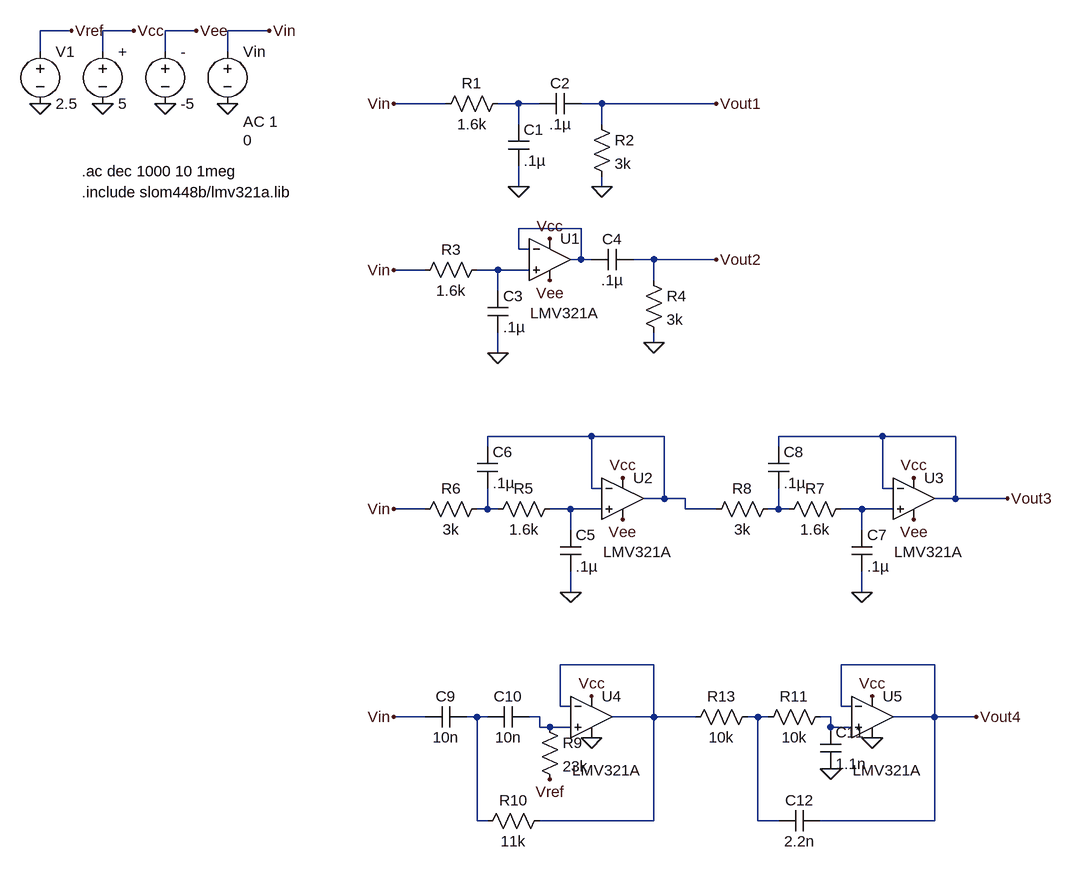
[diagram p0: schematic Draft5.asc]
Draft5.asc, the LTspice schematic file:
Version 4
SHEET 1 1956 1492
WIRE -416 0 -464 0
WIRE -320 0 -368 0
WIRE -224 0 -272 0
WIRE -112 0 -176 0
WIRE -464 32 -464 0
WIRE -368 32 -368 0
WIRE -272 32 -272 0
WIRE -176 32 -176 0
WIRE 160 112 80 112
WIRE 272 112 240 112
WIRE 304 112 272 112
WIRE 400 112 368 112
WIRE 576 112 400 112
WIRE 272 144 272 112
WIRE 400 144 400 112
WIRE 272 240 272 208
WIRE 400 240 400 224
WIRE 368 304 272 304
WIRE 272 336 272 304
WIRE 288 336 272 336
WIRE 368 352 368 304
WIRE 368 352 352 352
WIRE 384 352 368 352
WIRE 480 352 448 352
WIRE 576 352 480 352
WIRE 128 368 80 368
WIRE 240 368 208 368
WIRE 288 368 240 368
WIRE 480 384 480 352
WIRE 240 400 240 368
WIRE 480 480 480 464
WIRE 240 496 240 464
WIRE 384 624 224 624
WIRE 496 624 384 624
WIRE 832 624 672 624
WIRE 944 624 832 624
WIRE 224 640 224 624
WIRE 672 640 672 624
WIRE 384 704 384 624
WIRE 400 704 384 704
WIRE 832 704 832 624
WIRE 848 704 832 704
WIRE 496 720 496 624
WIRE 496 720 464 720
WIRE 528 720 496 720
WIRE 944 720 944 624
WIRE 944 720 912 720
WIRE 1024 720 944 720
WIRE 128 736 80 736
WIRE 224 736 224 704
WIRE 224 736 208 736
WIRE 240 736 224 736
WIRE 352 736 320 736
WIRE 400 736 352 736
WIRE 528 736 528 720
WIRE 576 736 528 736
WIRE 672 736 672 704
WIRE 672 736 656 736
WIRE 688 736 672 736
WIRE 800 736 768 736
WIRE 848 736 800 736
WIRE 352 768 352 736
WIRE 800 768 800 736
WIRE 352 864 352 832
WIRE 800 864 800 832
WIRE 480 976 336 976
WIRE 912 976 768 976
WIRE 336 1040 336 976
WIRE 352 1040 336 1040
WIRE 768 1040 768 976
WIRE 784 1040 768 1040
WIRE 128 1056 80 1056
WIRE 208 1056 192 1056
WIRE 224 1056 208 1056
WIRE 304 1056 288 1056
WIRE 480 1056 480 976
WIRE 480 1056 416 1056
WIRE 544 1056 480 1056
WIRE 640 1056 624 1056
WIRE 656 1056 640 1056
WIRE 752 1056 736 1056
WIRE 912 1056 912 976
WIRE 912 1056 848 1056
WIRE 976 1056 912 1056
WIRE 304 1072 304 1056
WIRE 320 1072 304 1072
WIRE 352 1072 320 1072
WIRE 752 1072 752 1056
WIRE 784 1072 752 1072
WIRE 208 1216 208 1056
WIRE 224 1216 208 1216
WIRE 480 1216 480 1056
WIRE 480 1216 304 1216
WIRE 640 1216 640 1056
WIRE 672 1216 640 1216
WIRE 912 1216 912 1056
WIRE 912 1216 736 1216
FLAG -176 112 0
FLAG 272 240 0
FLAG 400 240 0
FLAG 576 112 Vout1
FLAG -112 0 Vin
FLAG 80 112 Vin
FLAG 240 496 0
FLAG 480 480 0
FLAG 576 352 Vout2
FLAG 80 368 Vin
FLAG -272 112 0
FLAG -368 112 0
FLAG -320 0 Vcc
FLAG 320 320 Vcc
FLAG -224 0 Vee
FLAG 320 384 Vee
FLAG 352 864 0
FLAG 1024 720 Vout3
FLAG 80 736 Vin
FLAG 432 688 Vcc
FLAG 432 752 Vee
FLAG 800 864 0
FLAG 880 688 Vcc
FLAG 880 752 Vee
FLAG -416 0 Vref
FLAG -464 112 0
FLAG 320 1152 Vref
FLAG 80 1056 Vin
FLAG 384 1024 Vcc
FLAG 384 1088 0
FLAG 816 1024 Vcc
FLAG 752 1136 0
FLAG 816 1088 0
FLAG 976 1056 Vout4
SYMBOL voltage -176 16 R0
WINDOW 3 24 152 Left 2
WINDOW 123 24 124 Left 2
WINDOW 39 0 0 Left 0
SYMATTR InstName Vin
SYMATTR Value 0
SYMATTR Value2 AC 1
SYMBOL res 256 96 R90
WINDOW 0 0 56 VBottom 2
WINDOW 3 32 56 VTop 2
SYMATTR InstName R1
SYMATTR Value 1.6k
SYMBOL cap 256 144 R0
SYMATTR InstName C1
SYMATTR Value .1µ
SYMBOL cap 368 96 R90
WINDOW 0 0 32 VBottom 2
WINDOW 3 32 32 VTop 2
SYMATTR InstName C2
SYMATTR Value .1µ
SYMBOL res 384 128 R0
SYMATTR InstName R2
SYMATTR Value 3k
SYMBOL res 224 352 R90
WINDOW 0 0 56 VBottom 2
WINDOW 3 32 56 VTop 2
SYMATTR InstName R3
SYMATTR Value 1.6k
SYMBOL cap 224 400 R0
SYMATTR InstName C3
SYMATTR Value .1µ
SYMBOL cap 448 336 R90
WINDOW 0 0 32 VBottom 2
WINDOW 3 32 32 VTop 2
SYMATTR InstName C4
SYMATTR Value .1µ
SYMBOL res 464 368 R0
SYMATTR InstName R4
SYMATTR Value 3k
SYMBOL OpAmps\\opamp2 320 288 R0
WINDOW 3 -30 146 Left 2
SYMATTR InstName U1
SYMATTR Value LMV321A
SYMBOL voltage -272 16 R0
SYMATTR InstName -
SYMATTR Value -5
SYMBOL voltage -368 16 R0
SYMATTR InstName +
SYMATTR Value 5
SYMBOL OpAmps\\opamp2 432 656 R0
WINDOW 3 -30 146 Left 2
SYMATTR InstName U2
SYMATTR Value LMV321A
SYMBOL res 336 720 R90
WINDOW 0 0 56 VBottom 2
WINDOW 3 32 56 VTop 2
SYMATTR InstName R5
SYMATTR Value 1.6k
SYMBOL cap 336 768 R0
SYMATTR InstName C5
SYMATTR Value .1µ
SYMBOL res 224 720 R90
WINDOW 0 0 56 VBottom 2
WINDOW 3 32 56 VTop 2
SYMATTR InstName R6
SYMATTR Value 3k
SYMBOL cap 208 640 R0
SYMATTR InstName C6
SYMATTR Value .1µ
SYMBOL OpAmps\\opamp2 880 656 R0
WINDOW 3 -30 146 Left 2
SYMATTR InstName U3
SYMATTR Value LMV321A
SYMBOL res 784 720 R90
WINDOW 0 0 56 VBottom 2
WINDOW 3 32 56 VTop 2
SYMATTR InstName R7
SYMATTR Value 1.6k
SYMBOL cap 784 768 R0
SYMATTR InstName C7
SYMATTR Value .1µ
SYMBOL res 672 720 R90
WINDOW 0 0 56 VBottom 2
WINDOW 3 32 56 VTop 2
SYMATTR InstName R8
SYMATTR Value 3k
SYMBOL cap 656 640 R0
SYMATTR InstName C8
SYMATTR Value .1µ
SYMBOL cap 192 1040 R90
WINDOW 0 0 32 VBottom 2
WINDOW 3 32 32 VTop 2
SYMATTR InstName C9
SYMATTR Value 10n
SYMBOL cap 288 1040 R90
WINDOW 0 0 32 VBottom 2
WINDOW 3 32 32 VTop 2
SYMATTR InstName C10
SYMATTR Value 10n
SYMBOL OpAmps\\opamp2 384 992 R0
WINDOW 3 -30 146 Left 2
SYMATTR InstName U4
SYMATTR Value LMV321A
SYMBOL voltage -464 16 R0
SYMATTR InstName V1
SYMATTR Value 2.5
SYMBOL res 304 1056 R0
SYMATTR InstName R9
SYMATTR Value 23k
SYMBOL res 320 1200 R90
WINDOW 0 0 56 VBottom 2
WINDOW 3 32 56 VTop 2
SYMATTR InstName R10
SYMATTR Value 11k
SYMBOL OpAmps\\opamp2 816 992 R0
WINDOW 3 -30 146 Left 2
SYMATTR InstName U5
SYMATTR Value LMV321A
SYMBOL res 752 1040 R90
WINDOW 0 0 56 VBottom 2
WINDOW 3 32 56 VTop 2
SYMATTR InstName R11
SYMATTR Value 10k
SYMBOL res 640 1040 R90
WINDOW 0 0 56 VBottom 2
WINDOW 3 32 56 VTop 2
SYMATTR InstName R13
SYMATTR Value 10k
SYMBOL cap 736 1072 R0
SYMATTR InstName C11
SYMATTR Value 1.1n
SYMBOL cap 736 1200 R90
WINDOW 0 0 32 VBottom 2
WINDOW 3 32 32 VTop 2
SYMATTR InstName C12
SYMATTR Value 2.2n
TEXT -400 216 Left 2 !.ac dec 1000 10 1meg
TEXT -400 248 Left 2 !.include slom448b/lmv321a.lib

The netlist it stands for:
* Draft5.asc
Vin Vin 0 0 AC 1
R1 N001 Vin 1.6k
C1 N001 0 .1µ
C2 Vout1 N001 .1µ
R2 Vout1 0 3k
R3 N003 Vin 1.6k
C3 N003 0 .1µ
C4 Vout2 N002 .1µ
R4 Vout2 0 3k
XU1 N003 N002 Vcc Vee N002 LMV321A  ; pins In+ In- V+ V- OUT
V§- Vee 0 -5
V§+ Vcc 0 5
XU2 N006 N004 Vcc Vee N004 LMV321A  ; pins In+ In- V+ V- OUT
R5 N006 N005 1.6k
C5 N006 0 .1µ
R6 N005 Vin 3k
C6 N004 N005 .1µ
XU3 N008 Vout3 Vcc Vee Vout3 LMV321A  ; pins In+ In- V+ V- OUT
R7 N008 N007 1.6k
C7 N008 0 .1µ
R8 N007 N004 3k
C8 Vout3 N007 .1µ
C9 N010 Vin 10n
C10 N011 N010 10n
XU4 N011 N009 Vcc 0 N009 LMV321A  ; pins In+ In- V+ V- OUT
V1 Vref 0 2.5
R9 N011 Vref 23k
R10 N009 N010 11k
XU5 N013 Vout4 Vcc 0 Vout4 LMV321A  ; pins In+ In- V+ V- OUT
R11 N013 N012 10k
R13 N012 N009 10k
C11 N013 0 1.1n
C12 Vout4 N012 2.2n
.ac dec 1000 10 1meg
.include slom448b/lmv321a.lib
.backanno
.end